# Altium schematic sheet Aux_MCU_ATmega16U4.SchDoc
size A4
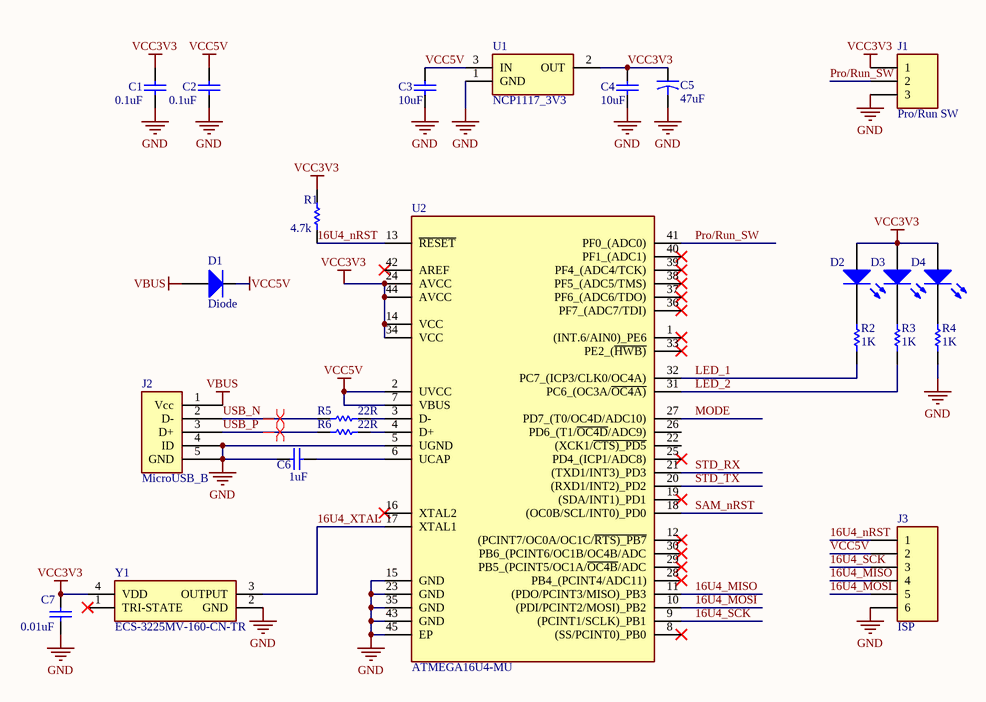
[diagram p0: Aux_MCU_ATmega16U4.SchDoc]

## Parts
C1  0.1uF  [SMD0603]
C2  0.1uF  [SMD0603]
C3  10uF  [SMD0603]
C4  10uF  [SMD0603]
C5  47uF  [TAJ_CLASS_C]
C6  1uF  [SMD0603]
C7  0.01uF  [SMD0603]
D1  Diode  [SMB_DIODE_B130LB]
D2  LED0  [SMD0603_LED]  (value not drawn)
D3  LED0  [SMD0603_LED]  (value not drawn)
D4  LED0  [SMD0603_LED]  (value not drawn)
J1  Pro/Run SW  [SLIDE_SW_3P]
J2  MicroUSB_B  [micro_usb_molex_105017-0001]
J3  ISP  [ISP]
R1  4.7K  [SMD0603]
R2  1K  [SMD0603]
R3  1K  [SMD0603]
R4  1K  [SMD0603]
R5  22R  [SMD0603]
R6  22R  [SMD0603]
U1  NCP1117_3V3  [SOT-223-2]
U2  ATMEGA16U4-MU  [QFN50P700X700X100-45N-D]
Y1  ECS-3225MV-160-CN-TR  [OSC3225]

## Nets
GND: C1.2 C2.2 C3.1 C4.1 C5.2 C6.1 C7.1 J1.3 J2.4(ID) J2.5(GND) J3.6 R4.1 U1.1(GND) U2.5(UGND) U2.15(GND) U2.23(GND) U2.35(GND) U2.43(GND) U2.45(EP) Y1.2(GND)
VBUS: D1.1(A) J2.1(Vcc)
VCC3V3: C1.1 C4.2 C5.1 C7.2 D2.1(A) D3.1(A) D4.1(A) J1.1 R1.2 U1.2(OUT) U2.14(VCC) U2.24(AVCC) U2.34(VCC) U2.44(AVCC) Y1.4(VDD)
VCC5V: C2.1 C3.2 D1.2(K) J3.2 U1.3(IN) U2.2(UVCC) U2.7(VBUS)
16U4_MISO: J3.4 U2.11((PDO/PCINT3/MISO)_PB3)
16U4_MOSI: J3.5 U2.10((PDI/PCINT2/MOSI)_PB2)
16U4_nRST: J3.1 R1.1 U2.13(~{RESET})
16U4_SCK: J3.3 U2.9((PCINT1/SCLK)_PB1)
16U4_XTAL: U2.17(XTAL1) Y1.3(OUTPUT)
LED_1: R2.1 U2.32(PC7_(ICP3/CLK0/OC4A))
LED_2: R3.1 U2.31(PC6_(OC3A/~{OC4A)})
MODE: U2.27(PD7_(T0/OC4D/ADC10))
Pro/Run_SW: J1.2 U2.41(PF0_(ADC0))
SAM_nRST: U2.18((OC0B/SCL/INT0)_PD0)
STD_RX: U2.21((TXD1/INT3)_PD3)
STD_TX: U2.20((RXD1/INT2)_PD2)
USB_N: J2.2(D-) R5.2
USB_P: J2.3(D+) R6.2
NetC6_2: C6.2 U2.6(UCAP)
NetD2_2: D2.2(K) R2.2
NetD3_2: D3.2(K) R3.2
NetD4_2: D4.2(K) R4.2
NetR5_1: R5.1 U2.3(D-)
NetR6_1: R6.1 U2.4(D+)

Not connected (* = marked no-connect by the designer): U2 1((INT.6/AIN0)_PE6)* 8((SS/PCINT0)_PB0)* 12((PCINT7/OC0A/OC1C/~{RTS)_PB7})* 16(XTAL2)* 19((SDA/INT1)_PD1)* 22((XCK1/~{CTS)_PD5}) 25(PD4_(ICP1/ADC8))* 26(PD6_(T1/~{OC4D}/ADC9)) 28(PB4_(PCINT4/ADC11))* 29(PB5_(PCINT5/OC1A/~{OC4B}/ADC)* 30(PB6_(PCINT6/OC1B/OC4B/ADC)* 33(PE2_(~{HWB)})* 36(PF7_(ADC7/TDI))* 37(PF6_(ADC6/TDO))* 38(PF5_(ADC5/TMS))* 39(PF4_(ADC4/TCK))* 40(PF1_(ADC1))* 42(AREF)*; Y1 1(TRI-STATE)*

## Layout directives
differential pair: USB_N, USB_P

## Notes on the sheet
- Title
- Size:
- Date:
- A4
- Number:
- Time:
- Revision:
- Sheet
- of
- File:

## Library data of the parts
C1-C4 C6 C7 = Cap Semi: Capacitor (Semiconductor SIM Model); Published: 8-Jun-2000; LatestRevisionDate: 29-May-2009; LatestRevisionNote: IPC-7351 Footprint Added.; PackageReference: C1206; Publisher: Altium Limited; PackageDescription: Chip Capacitor
  C1 C2: Value: 0.1uF
  C3 C4: Value: 10uF
  C6: Value: 1uF
  C7: Value: 0.01uF
C5 = Cap2: Capacitor; Published: 23-Sep-2002; PackageReference: CAPR5-4X5; Publisher: Altium Limited; Value: 47uF
D1 = Diode: Default Diode; Published: 8-Jun-2000; LatestRevisionDate: 17-Jul-2002; LatestRevisionNote: Re-released for DXP Platform.; PackageVersion: Sep-1996; PackageReference: SMC; Publisher: Altium Limited; PackageDescription: DO-214-AB/SMC; 2 C-Bend Leads; Body 7.9 x 5.9 mm, inc. leads (LxW); Code_JEDEC: DO-214-AB
D2-D4 = LED0: Typical INFRARED GaAs LED; Published: 8-Jun-2000; LatestRevisionDate: 08-Jul-2005; LatestRevisionNote: Mech Layer 1 removed.; PackageReference: LED-0; Publisher: Altium Limited; PackageDescription: LED; 2 Leads
J1 = Pro/Run SW: Program/Run Switch
R1 R5 R6 = Res: Semiconductor Resistor
  R1: Value: 4.7k
  R5 R6: Value: 22R
R2-R4 = Res Semi: Semiconductor Resistor; Published: 8-Jun-2000; LatestRevisionDate: 17-Jul-2002; LatestRevisionNote: Re-released for DXP Platform.; PackageReference: AXIAL-0.5; Publisher: Altium Limited; PackageDescription: Axial Device, Thru-Hole; 2 Leads; 0.5 in Pin Spacing; Value: 1K
U1 = NCP1117_3V3: IC REG 3.3V 1A DPAC
U2 = ATMEGA16U4-MU: Integrated Circuit; Manufacturer_Name: Microchip; Datasheet Link: http://ww1.microchip.com/downloads/en/DeviceDoc/Atmel-7766-8-bit-AVR-ATmega16U4-32U4_Summary.pdf; Height: 1mm; Manufacturer_Part_Number: ATMEGA16U4-MU
Y1 = ECS-3225MV-160-CN-TR: Crystal or Oscillator; Manufacturer_Name: ECS; Datasheet Link: https://componentsearchengine.com//ECS-3225MV-160-CN-TR.pdf; Height: 1.2mm; Mouser2 Part Number: 520-3225MV-160-CNT; Mouser2 Price/Stock: https://www.mouser.com/Search/Refine.aspx?Keyword=520-3225MV-160-CNT; Manufacturer_Part_Number: ECS-3225MV-160-CN-TR